# Altium schematic sheet B21DCDT245_05.SchDoc
size A4; SheetNumber: 1; SheetTotal: 1
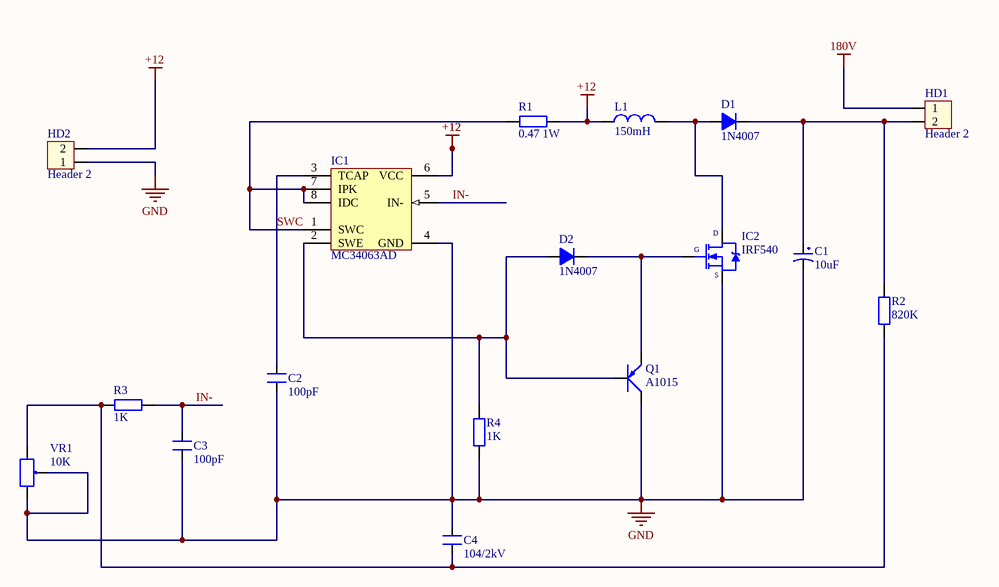
[diagram p0: B21DCDT245_05.SchDoc]

## Parts
C1  10uF  [CP1/2]
C2  100pF  [CN1]
C3  100pF  [CN1]
C4  104/2kV  [CN1]
D1  1N4007  [D1A]
D2  1N4007  [D1A]
HD1  Header 2  [HED2]
HD2  Header 2  [HED2]
IC1  MC34063AD  [DIP8]
IC2  IRF540  [QTO220 - FLAT]
L1  150mH  [L/0.4]
Q1  A1015  [QTO-92]
R1  0.47 1W  [SM-1206]
R2  820K  [SM-1206]
R3  1K  [SM-1206]
R4  1K  [SM-1206]
VR1  10K  [VR]

## Nets
180V: HD1.1
+12: HD2.2 IC1.6(VCC) L1.1 R1.1
GND: C1.2 C2.1 C3.1 C4.2 HD2.1 IC1.4(GND) IC2.3(S) Q1.2(C) R4.2 VR1.2 VR1.3
IN-: C3.2 IC1.5(IN-) R3.2
SWC: C2.2 IC1.1(SWC) IC1.3(TCAP) IC1.7(IPK) IC1.8(IDC) R1.2
NetC1_1: C1.1 D1.2(K) HD1.2 R2.1
NetC4_1: C4.1 R2.2 R3.1 VR1.1
NetD1_1: D1.1(A) IC2.2(D) L1.2
NetD2_1: D2.1(A) IC1.2(SWE) Q1.3(B) R4.1
NetD2_2: D2.2(K) IC2.1(G) Q1.1(E)

## Library data of the parts
C1 = CP1: Cap P  0,1uF < 22uF , 16 - 50V; Value: 10uF/50V; Description 1: 10 => 220uF/6,3V/10V - 10uF => 100uF/16V; Description 2: 0,1uF => 33uF/50V - 10uF => 22uF/63V; Description 3: 0,47uF => 10uF/100V
C2 C3 = CN1: Cap np  1pF - 472pF; Value: 100pF
C4 = CN1: Cap np  1pF - 472pF; Value: 100pF
D1 D2 = D1A: Diode 1A; Value: 1N4007
HD1 HD2 = Hed2: Header 2 (Green); Value: Header 2
IC1 = MC34063AD: DC-to-DC Converter Control Circuit; Published: 15-Apr-2002; LatestRevisionDate: 13-Apr-2006; LatestRevisionNote: IPC-7351 Footprint Added.; DatasheetVersion: 1996; PackageVersion: 1998; PackageReference: 751-05; Publisher: Altium Limited; PackageDescription: 8-Pin Small Outline Integrated Circuit 1.27 mm Pitch; Code_JEDEC: MS-012-AA; Code_IPC: SOIC127P600-8; ComponentLink1Description: Manufacturer Link; ComponentLink1URL: http://www.onsemi.com/site/products/taxonomy/0,4438,503,00.html; ComponentLink2Description: Datasheet; ComponentLink2URL: http://www.onsemi.com/pub/Collateral/MC34063A-D.PDF
L1 = L1: Inductor; Value: 150 mH
Q1 = A1015: PNP 600mW, ECB; Value: A1015
R1 R2 = RM: Resistor SMD; Value: 1K
R3 R4 = RM: Resistor SMD; Value: 1K
VR1 = VR: Var Resistor; Value: VR 10K